# Altium schematic sheet ShifterMatic.SchDoc
size B
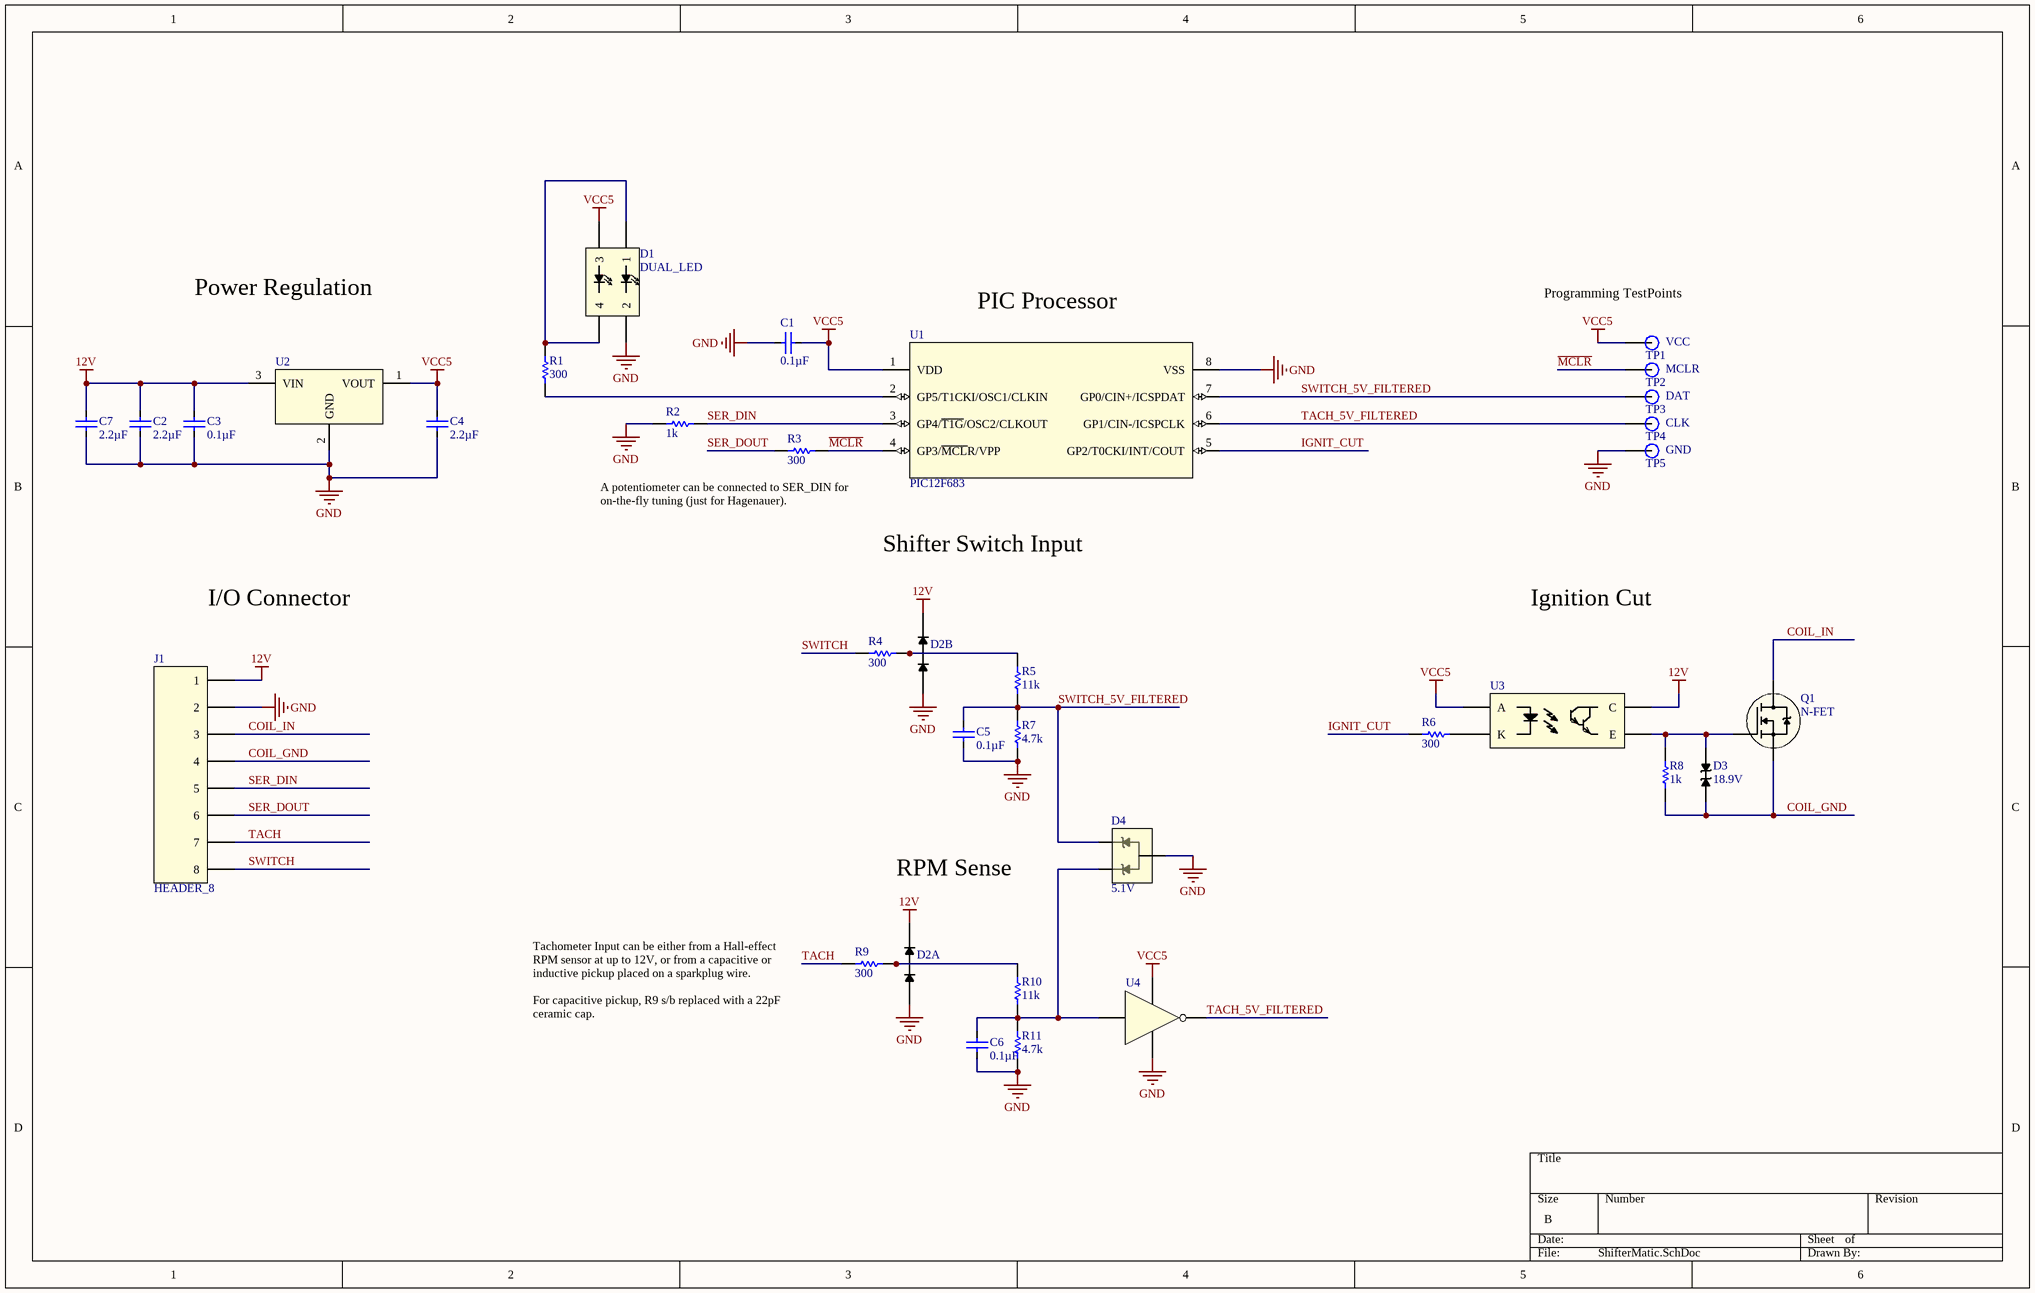
[diagram p0: ShifterMatic.SchDoc]

## Parts
C1  0.1µF  [CAP_0603]
C2  2.2µF  [CAP_0805]
C3  0.1µF  [CAP_0603]
C4  2.2µF  [CAP_0805]
C5  0.1µF  [CAP_0603]
C6  0.1µF  [CAP_0603]
C7  2.2µF  [CAP_0805]
D1  DUAL_LED  [KINGBRIGHT_DUAL_SMT_LED]
D2  DIODE_ARRAY_BAS40BRW  [SOT65P210X110-6N]  (value not drawn)  (parts A,B of 2)
D3  18.9V  [DO-214AC_SMA_NONPOLARIZED]
D4  5.1V  [SOT65P210X110-3N]
J1  HEADER_8  [MOLEX_MINIFIT_JR_8_PIN]
Q1  N-FET  [DPAK228P970X238-3N]
R1  300  [RES_0603]
R2  1k  [RES_0603]
R3  300  [RES_0603]
R4  300  [RES_0603]
R5  11k  [RES_0603]
R6  300  [RES_0603]
R7  4.7k  [RES_0603]
R8  1k  [RES_0603]
R9  300  [RES_0603]
R10  11k  [RES_0603]
R11  4.7k  [RES_0603]
TP1  VCC  [PAD_40MIL]  (no BOM)
TP2  MCLR  [PAD_40MIL]  (no BOM)
TP3  DAT  [PAD_40MIL]  (no BOM)
TP4  CLK  [PAD_40MIL]  (no BOM)
TP5  GND  [PAD_40MIL]  (no BOM)
U1  PIC12F683  [SOIC127P600X175-8N]
U2  LDO_NO_ENABLE  [SOT230P700X180-4N]  (value not drawn)
U3  OPTOISOLATOR_DARLINGTON  [SOP254P680X220-4N]  (value not drawn)
U4  SCHMITT_TRIGGER  [SOT95P245X110-5N]  (value not drawn)

## Nets
12V: C2.1 C3.2 C7.1 D2.4(C2) D2.5(C1) J1.1 U2.3(VIN) U3.4(C)
GND: C1.2 C2.2 C3.1 C4.2 C5.1 C6.1 C7.2 D1.2 D2.1(A1) D2.2(A2) D4.3(CA) J1.2 R2.2 R7.1 R11.1 TP5.1 U1.8(VSS) U2.2(GND) U4.3(GND)
VCC5: C1.1 C4.1 D1.3 TP1.1 U1.1(VDD) U2.1(VOUT) U3.1(A) U4.5(VCC)
COIL_GND: D3.1 J1.4 Q1.3(S) R8.2
COIL_IN: J1.3 Q1.4(D)
IGNIT_CUT: R6.1 U1.5(GP2/T0CKI/INT/COUT)
~{MCLR}: R3.2 TP2.1 U1.4(GP3/~{MCL}R/VPP)
SER_DIN: J1.5 R2.1 U1.3(GP4/~{T1G}/OSC2/CLKOUT)
SER_DOUT: J1.6 R3.1
SWITCH: J1.8 R4.1
SWITCH_5V_FILTERED: C5.2 D4.1(C1) R5.1 R7.2 TP3.1 U1.7(GP0/CIN+/ICSPDAT)
TACH: J1.7 R9.1
TACH_5V_FILTERED: TP4.1 U1.6(GP1/CIN-/ICSPCLK) U4.4(Y)
NetC6_2: C6.2 D4.2(C2) R10.1 R11.2 U4.2(A)
NetD1_1: D1.1 D1.4 R1.1
NetD2_3: D2.3(AC2) R4.2 R5.2
NetD2_6: D2.6(AC1) R9.2 R10.2
NetD3_2: D3.2 Q1.1(G) R8.1 U3.3(E)
NetR1_2: R1.2 U1.2(GP5/T1CKI/OSC1/CLKIN)
NetR6_2: R6.2 U3.2(K)

Not connected (* = marked no-connect by the designer): U4 1(NC)

## Notes on the sheet
- Power Regulation
- (near TP1) Programming TestPoints
- PIC Processor
- (near R3) A potentiometer can be connected to SER_DIN for on-the-fly tuning (just for Hagenauer).
- Shifter Switch Input
- I/O Connector
- Ignition Cut
- RPM Sense
- Tachometer Input can be either from a Hall-effect RPM sensor at up to 12V, or from a capacitive or inductive pickup placed on a sparkplug wire.
  For capacitive pickup, R9 s/b replaced with a 22pF ceramic cap.

## Library data of the parts
C1 C3 C5 C6 = CAPACITOR: Temperature Coefficient: X7R; Tolerance: ±10%; Voltage - Rated: 50V; Capacitance: 0.1µF; Supplier 1: Digi-Key; Supplier Part Number 1: 1276-1936-1-ND; Features: Soft Termination
C2 C4 C7 = CAPACITOR: Temperature Coefficient: X7R; Voltage - Rated: 35V; Tolerance: ±20%; Capacitance: 2.2µF; Supplier 1: Digi-Key; Supplier Part Number 1: 445-6799-1-ND; Features: Soft Termination
D3 = TVS_BIDIRECTIONAL: Voltage - Reverse Standoff (Typ): 17V; Supplier 1: Digi-Key; Supplier Part Number 1: SMAJ17CABDKR-ND; Package / Case: DO-214AC, SMA; Voltage - Breakdown: 18.9V
D4 = DUAL_ZENER_COM_ANODE: Supplier 1: Digi-Key; Supplier Part Number 1: AZ23C5V1-TPMSDKR-ND; Package / Case: TO-236-3, SC-59, SOT-23-3; Voltage: 5.1V
J1 = HEADER_8: Manufacturer Part Number: 0039291088; Manufacturer: Molex Inc; Number of Positions: 8; Supplier 1: Digi-Key; Supplier Part Number 1: WM3903-ND
Q1 = N-FET: Rds On (Max) @ Id, Vgs: 16 mOhm @ 20A, 10V; Drain to Source Voltage (Vdss): 60V; Supplier 1: Digi-Key; Supplier Part Number 1: NTD5865NLT4GOSDKR-ND; ComponentLink1URL: http://www.onsemi.com/pub_link/Collateral/NTD5865NL-D.PDF; ComponentLink1Description: http://www.onsemi.com/pub_link/Collateral/NTD5865NL-D.PDF
R1-R11 = RESISTOR: =Description; Power (Watts): 0.25W, 1/4W; Tolerance: ±5%; Supplier 1: Digi-Key
  R1 R3 R4 R6 R9: Resistance: 300; Supplier Part Number 1: RHM300DCT-ND; Package / Case: 0603 (1608 Metric)
  R2 R8: Supplier Part Number 1: RHM1.0KDCT-ND; Resistance: 1k
  R5 R10: Resistance: 11k; Supplier Part Number 1: RHM11KDCT-ND; Package / Case: 0603 (1608 Metric)
  R7 R11: Resistance: 4.7k; Supplier Part Number 1: RHM4.7KDCT-ND; Package / Case: 0603 (1608 Metric)
TP1-TP5 = TestPoint SMT 40mil: Test Point, 40-mil diameter; Part Number: TestPoint SMT 40mil
U1 = PIC12F675: Supplier 1: Digi-Key; Supplier Part Number 1: PIC12F683-I/SN-ND
U2 = LDO_NO_ENABLE: Voltage - Output: 5V; Voltage - Input: 7 V ~ 20 V; Current - Output: 200mA (Max); Supplier 1: Digi-Key; Supplier Part Number 1: ZSR500GCT-ND; Operating Temperature: -55°C ~ 125°C
U3 = OPTOISOLATOR_DARLINGTON: Voltage - Isolation: 3750Vrms; Voltage - Output: 35V; Current - DC Forward (If): 50mA; Current - Output / Channel: 80mA; Supplier 1: Digi-Key; Supplier Part Number 1: 160-1335-1-ND; ComponentLink1URL: http://optoelectronics.liteon.com/upload/download/DS70-2001-006/P_100_LTV-355T%20Series-1308.pdf; ComponentLink1Description: http://optoelectronics.liteon.com/upload/download/DS70-2001-006/P_100_LTV-355T%20Series-1308.pdf
U4 = SCHMITT_TRIGGER: Voltage - Supply: 3 V ~ 18 V; Supplier 1: Digi-Key; Supplier Part Number 1: TC4S584F(T5LFT)DKR-ND; ComponentLink1URL: http://www.toshiba.com/taec/components2/Datasheet_Sync//164/7400.pdf; ComponentLink1Description: http://www.toshiba.com/taec/components2/Datasheet_Sync//164/7400.pdf; Operating Temperature: -40°C ~ 85°C
D1 = DUAL_LED: Supplier 1: Digi-Key; Supplier Part Number 1: 754-1648-1-ND
D2 = DIODE_ARRAY_BAS40BRW: Supplier 1: Digi-Key; Supplier Part Number 1: BAS40BRW-FDIDKR-ND